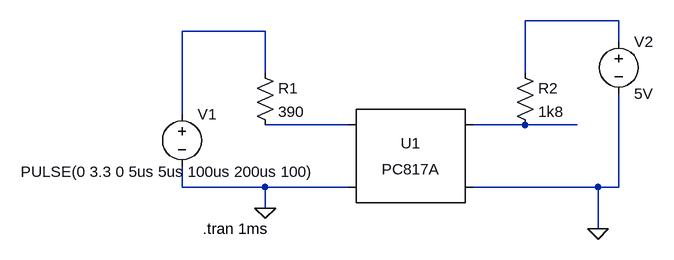
[diagram p0: schematic RPi-LTV817.asc]
RPi-LTV817.asc, the LTspice schematic file:
Version 4
SHEET 1 880 680
WIRE 512 -48 368 -48
WIRE -32 -32 -160 -32
WIRE 512 -16 512 -48
WIRE -32 32 -32 -32
WIRE 368 32 368 -48
WIRE -160 96 -160 -32
WIRE 96 112 -32 112
WIRE 368 112 288 112
WIRE 448 112 368 112
WIRE -160 208 -160 176
WIRE -32 208 -160 208
WIRE 96 208 -32 208
WIRE 480 208 288 208
WIRE 512 208 512 64
WIRE 512 208 480 208
WIRE -32 240 -32 208
WIRE 480 272 480 208
FLAG -32 240 0
FLAG 480 272 0
SYMBOL Optos\\PC817A 192 160 R0
SYMATTR InstName U1
SYMBOL res -48 16 R0
SYMATTR InstName R1
SYMATTR Value 390
SYMBOL res 352 16 R0
SYMATTR InstName R2
SYMATTR Value 1k8
SYMBOL voltage 512 -32 R0
WINDOW 123 0 0 Left 2
WINDOW 39 0 0 Left 2
SYMATTR InstName V2
SYMATTR Value 5V
SYMBOL voltage -160 80 R0
WINDOW 3 -248 104 Left 2
WINDOW 123 0 0 Left 2
WINDOW 39 0 0 Left 2
SYMATTR Value PULSE(0 3.3 0 5us 5us 100us 200us 100)
SYMATTR InstName V1
TEXT -128 272 Left 2 !.tran 1ms

The netlist it stands for:
* RPi-LTV817.asc
XU1 N003 0 N004 0 PC817 Igain=1m
R1 N002 N003 390
R2 N001 N004 1k8
V2 N001 0 5V
V1 N002 0 PULSE(0 3.3 0 5us 5us 100us 200us 100)
.tran 1ms
.lib PC817.sub
.backanno
.end